# Altium schematic sheet RP2040_MCU.SchDoc: RP2040 CNC
size B; Author: AM; CompanyName: Expatria Technologies; DrawnBy: A.Marles; Engineer: AM; Organization: Expatria Technolgoies; Address1: Schematic; DocumentNumber: 3; SheetNumber: 3; SheetTotal: 4
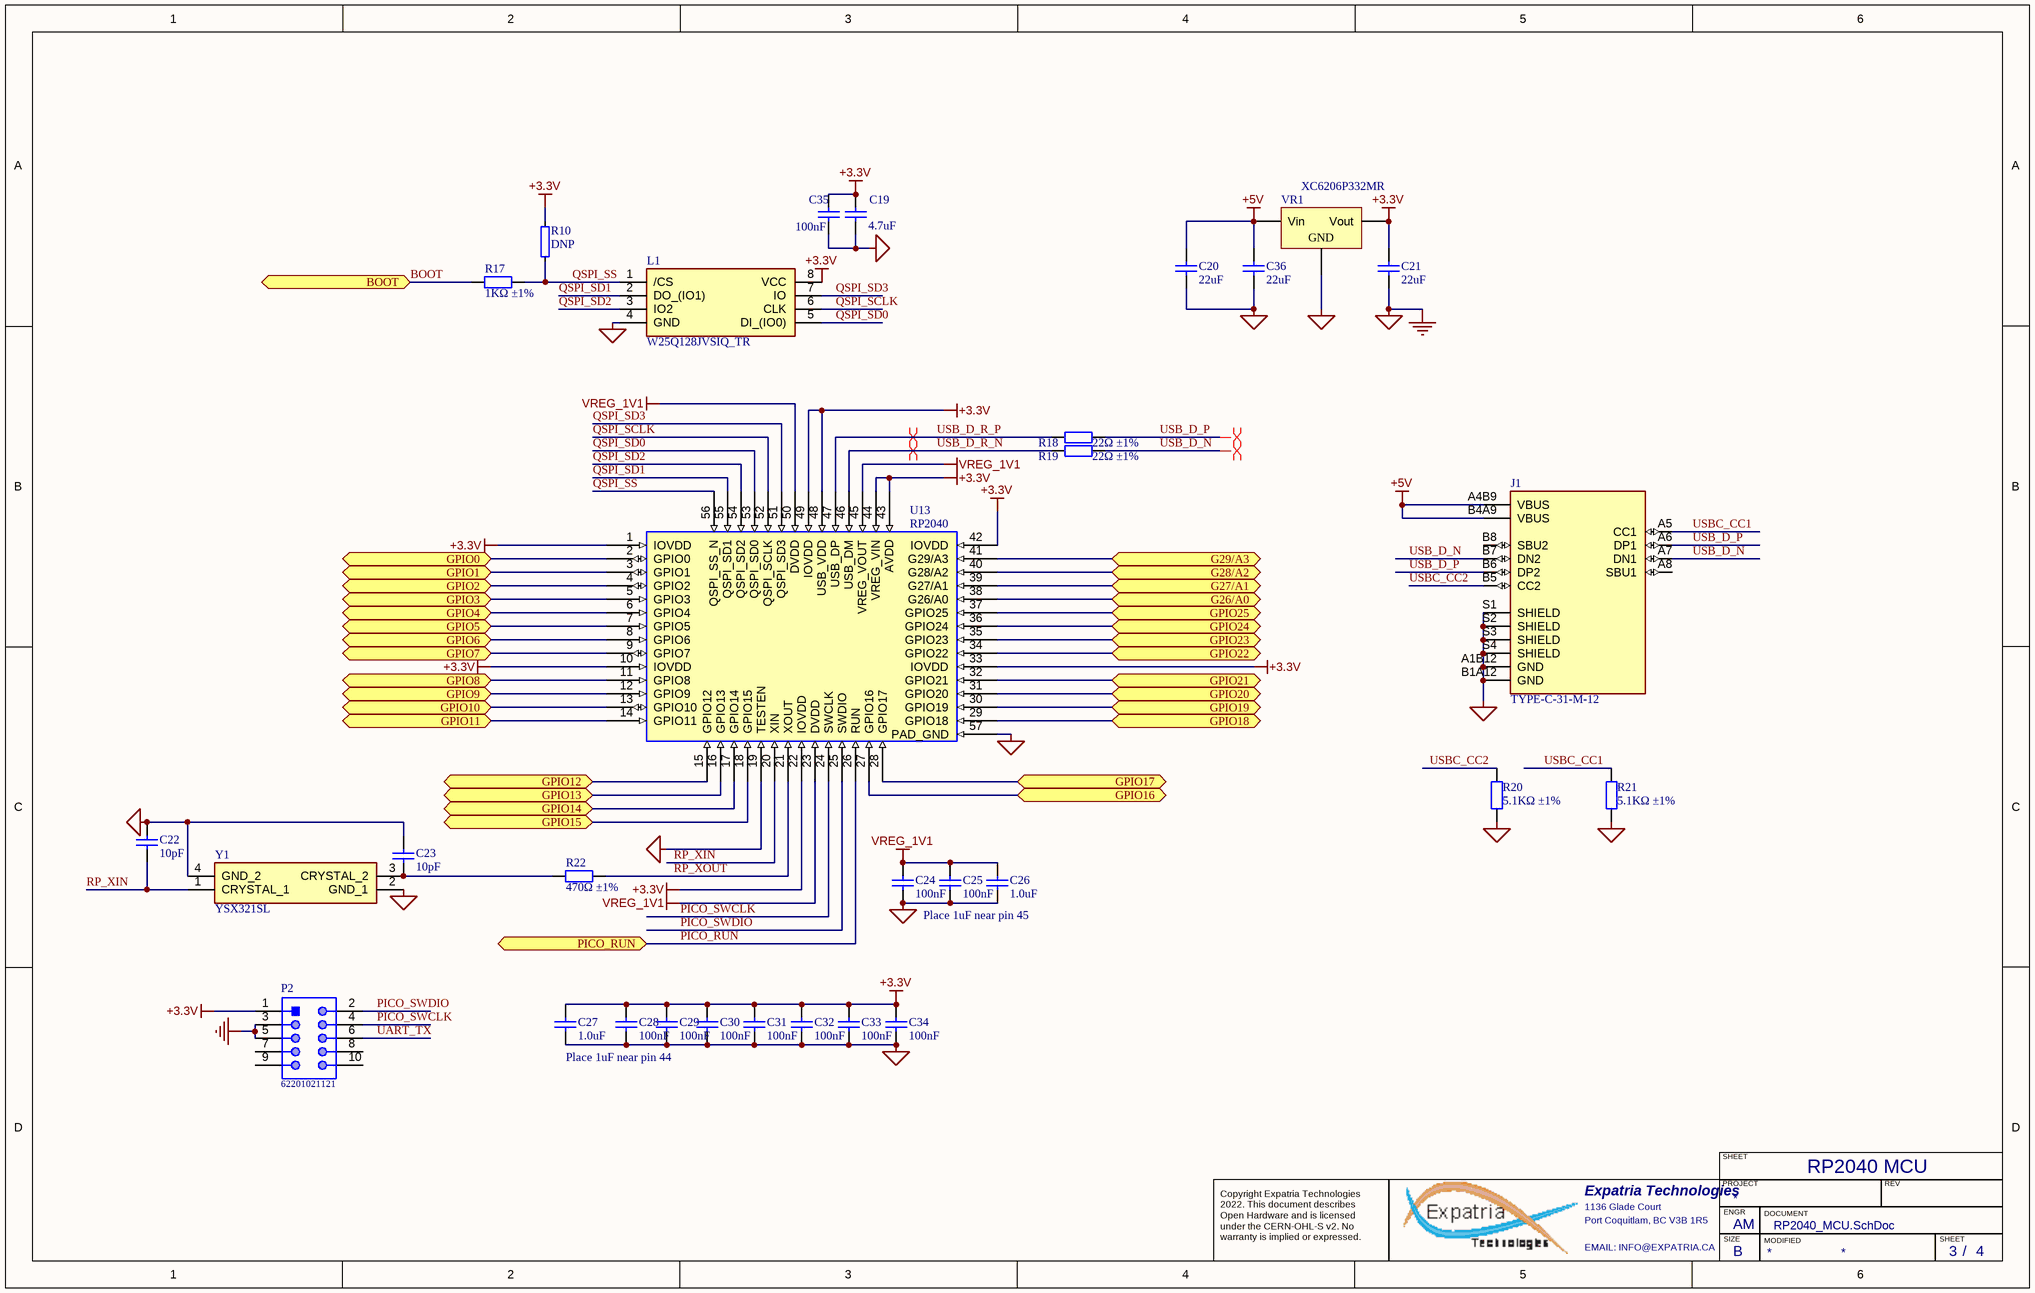
[diagram p0: RP2040_MCU.SchDoc]

## Parts
C19  4.7uF  [0402_C]
C20  22uF  [0805_C]
C21  22uF  [0805_C]
C22  10pF  [0402_C]
C23  10pF  [0402_C]
C24  100nF  [0402_C]
C25  100nF  [0402_C]
C26  1.0uF  [0402_C]
C27  1.0uF  [0402_C]
C28  100nF  [0402_C]
C29  100nF  [0402_C]
C30  100nF  [0402_C]
C31  100nF  [0402_C]
C32  100nF  [0402_C]
C33  100nF  [0402_C]
C34  100nF  [0402_C]
C35  100nF  [0402_C]
C36  22uF  [0805_C]
J1  TYPE-C-31-M-12  [HRO_TYPE-C-31-M-12]
L1  W25Q128JVSIQ_TR  [SOIC127P780X195-8N]
P2  62201021121  [62201021121]  (no BOM)
R10  DNP  [0402]
R17  1KΩ ±1%  [0402_R]
R18  22Ω ±1%  [0402_R]
R19  22Ω ±1%  [0402_R]
R20  5.1KΩ ±1%  [0402_R]
R21  5.1KΩ ±1%  [0402_R]
R22  470Ω ±1%  [0402_R]
U13  RP2040  [RP2040]
VR1  XC6206P332MR  [SOT-23-3L]
Y1  YSX321SL  [YSX321SL]

## Ports
BOOT (bidir), G26/A0 (bidir), G27/A1 (bidir), G28/A2 (bidir), G29/A3 (bidir), GPIO0 (bidir), GPIO1 (bidir), GPIO2 (bidir), GPIO3 (bidir), GPIO4 (bidir), GPIO5 (bidir), GPIO6 (bidir), GPIO7 (bidir), GPIO8 (bidir), GPIO9 (bidir), GPIO10 (bidir), GPIO11 (bidir), GPIO12 (bidir), GPIO13 (bidir), GPIO14 (bidir), GPIO15 (bidir), GPIO16 (bidir), GPIO17 (bidir), GPIO18 (bidir), GPIO19 (bidir), GPIO20 (bidir), GPIO21 (bidir), GPIO22 (bidir), GPIO23 (bidir), GPIO24 (bidir), GPIO25 (bidir), PICO_RUN (bidir)

## Nets
+3.3V: C19.2 C21.2 C27.2 C28.2 C29.2 C30.2 C31.2 C32.2 C33.2 C34.2 C35.2 L1.8(VCC) P2.1 R10.2 U13.1(IOVDD) U13.10(IOVDD) U13.22(IOVDD) U13.33(IOVDD) U13.42(IOVDD) U13.43(AVDD) U13.44(VREG_VIN) U13.48(USB_VDD) U13.49(IOVDD) VR1.2(Vout)
+5V: C20.2 C36.2 J1.A4B9(VBUS) J1.B4A9(VBUS) VR1.3(Vin)
GND: C19.1 C20.1 C21.1 C22.2 C23.2 C24.1 C25.1 C26.1 C27.1 C28.1 C29.1 C30.1 C31.1 C32.1 C33.1 C34.1 C35.1 C36.1 J1.A1B12(GND) J1.B1A12(GND) J1.S1(SHIELD) J1.S2(SHIELD) J1.S3(SHIELD) J1.S4(SHIELD) L1.4(GND) P2.3 P2.5 R20.2 R21.2 U13.19(TESTEN) U13.57(PAD_GND) VR1.1(GND) Y1.2(GND_1) Y1.4(GND_2)  [also labelled MCU_GND]
VREG_1V1: C24.2 C25.2 C26.2 U13.23(DVDD) U13.45(VREG_VOUT) U13.50(DVDD)
BOOT: R17.1 ; port BOOT
G26/A0: U13.38(G26/A0) ; port G26/A0
G27/A1: U13.39(G27/A1) ; port G27/A1
G28/A2: U13.40(G28/A2) ; port G28/A2
G29/A3: U13.41(G29/A3) ; port G29/A3
GPIO0: U13.2(GPIO0) ; port GPIO0
GPIO1: U13.3(GPIO1) ; port GPIO1
GPIO2: U13.4(GPIO2) ; port GPIO2
GPIO3: U13.5(GPIO3) ; port GPIO3
GPIO4: U13.6(GPIO4) ; port GPIO4
GPIO5: U13.7(GPIO5) ; port GPIO5
GPIO6: U13.8(GPIO6) ; port GPIO6
GPIO7: U13.9(GPIO7) ; port GPIO7
GPIO8: U13.11(GPIO8) ; port GPIO8
GPIO9: U13.12(GPIO9) ; port GPIO9
GPIO10: U13.13(GPIO10) ; port GPIO10
GPIO11: U13.14(GPIO11) ; port GPIO11
GPIO12: U13.15(GPIO12) ; port GPIO12
GPIO13: U13.16(GPIO13) ; port GPIO13
GPIO14: U13.17(GPIO14) ; port GPIO14
GPIO15: U13.18(GPIO15) ; port GPIO15
GPIO16: U13.27(GPIO16) ; port GPIO16
GPIO17: U13.28(GPIO17) ; port GPIO17
GPIO18: U13.29(GPIO18) ; port GPIO18
GPIO19: U13.30(GPIO19) ; port GPIO19
GPIO20: U13.31(GPIO20) ; port GPIO20
GPIO21: U13.32(GPIO21) ; port GPIO21
GPIO22: U13.34(GPIO22) ; port GPIO22
GPIO23: U13.35(GPIO23) ; port GPIO23
GPIO24: U13.36(GPIO24) ; port GPIO24
GPIO25: U13.37(GPIO25) ; port GPIO25
PICO_RUN: U13.26(RUN) ; port PICO_RUN
PICO_SWCLK: P2.4 U13.24(SWCLK)
PICO_SWDIO: P2.2 U13.25(SWDIO)
QSPI_SCLK: L1.6(CLK) U13.52(QSPI_SCLK)
QSPI_SD0: L1.5(DI_(IO0)) U13.53(QSPI_SD0)
QSPI_SD1: L1.2(DO_(IO1)) U13.55(QSPI_SD1)
QSPI_SD2: L1.3(IO2) U13.54(QSPI_SD2)
QSPI_SD3: L1.7(IO) U13.51(QSPI_SD3)
QSPI_SS: L1.1(/CS) R10.1 R17.2 U13.56(QSPI_SS_N)
RP_XIN: C22.1 U13.20(XIN) Y1.1(CRYSTAL_1)
RP_XOUT: R22.2 U13.21(XOUT)
UART_TX: P2.6
USB_D_N: J1.A7(DN1) J1.B7(DN2) R19.1
USB_D_P: J1.A6(DP1) J1.B6(DP2) R18.1
USB_D_R_N: R19.2 U13.46(USB_DM)
USB_D_R_P: R18.2 U13.47(USB_DP)
USBC_CC1: J1.A5(CC1) R21.1
USBC_CC2: J1.B5(CC2) R20.1
NetC23_1: C23.1 R22.1 Y1.3(CRYSTAL_2)

Not connected (* = marked no-connect by the designer): J1 A8(SBU1) B8(SBU2); P2 7 8 9 10

## Layout directives
differential pair: USB_D_N, USB_D_P, USB_D_R_N, USB_D_R_P

## Notes on the sheet
- Place 1uF near pin 45
- Place 1uF near pin 44
- RP2040 MCU
- SHEET
- Expatria Technologies
- 1136 Glade Court
- Port Coquitlam, BC V3B 1R5
- PROJECT
- SIZE
- ENGR
- MODIFIED
- DOCUMENT
- REV
- Copyright Expatria Technologies 2022. This document describes Open Hardware and is licensed under the CERN-OHL-S v2. No warranty is implied or expressed.
- EMAIL: INFO@EXPATRIA.CA
- B
- /

## Library data of the parts
C19 = 0402 4.7uF (475) 20% 10V: Chip capacitor; Manufacturer: Samsung Electro-Mechanics; PartNumber: CL05A475MP5NRNC; Tolerance: 20%; Voltage: 10V; ComponentLink1Description: Supplier link; ComponentLink1URL: http://www.szlcsc.com/product/details_24469.html; Package: 0402; Supplier: LC; SuppliersPartNumber: C23733; Capacitance: 4.7uF
C20 C21 C36 = 0805 22uF (226) 20% 25V: Chip capacitors; Manufacturer: Samsung Electro-Mechanics; PartNumber: CL21A226MAQNNNE; Tolerance: 20%; Voltage: 25V; Package: 0805; Supplier: LC; SuppliersPartNumber: C2922481; Capacitance: 22uF; ComponentLink1Description: Supplier link; ComponentLink1URL: http://www.szlcsc.com/product/details_46786.html
C22 C23 = 0402 10pF (100) 5% 50V: Chip capacitors; Manufacturer: Samsung Electro-Mechanics; PartNumber: CL05C100JB5NNNC; Tolerance: 5%; Voltage: 50V; ComponentLink1Description: Supplier link; ComponentLink1URL: http://www.szlcsc.com/product/details_33914.html; Package: 0402; Supplier: LC; SuppliersPartNumber: C32949; Capacitance: 10pF
C24 C25 C28-C35 = 0402 100nF (104) 10% 16V: Chip capacitors; Manufacturer: Samsung Electro-Mechanics; PartNumber: CL05B104KO5NNNC; Tolerance: 10%; Voltage: 16V; ComponentLink1Description: Supplier link; ComponentLink1URL: http://www.szlcsc.com/product/details_1877.html; Package: 0402; Supplier: LC; SuppliersPartNumber: C1525; Capacitance: 100nF
C26 C27 = 0402 1.0uF (105) 10% 25V: Chip capacitor; Manufacturer: Samsung Electro-Mechanics; PartNumber: CL05A105KA5NQNC; Capacitance: 1uF; Tolerance: 10%; Voltage: 25V; ComponentLink1Description: Supplier link; ComponentLink1URL: http://www.szlcsc.com/product/details_53938.html; Package: 0402; Supplier: LC; SuppliersPartNumber: C52923
J1 = TYPE-C-31-M-12: USB Connectors 24 Receptacle 1 8.94*7.3mm RoHS; MF: HRO Electronics Co., Ltd.; Value: *; SnapEDA_Link: https://www.snapeda.com/parts/TYPE-C-31-M-12/HRO%20Electronics%20Co.,%20Ltd./view-part/3228496/?ref=snap; Package: Package; MP: TYPE-C-31-M-12; Price: None; Availability: Unavailable; SuppliersPartNumber: C165948
L1 = W25Q128JVSIQ_TR: Inductor; Manufacturer_Name: Winbond; Manufacturer_Part_Number: W25Q128JVSIQ TR; Datasheet Link: http://www.winbond.com/resource-files/w25q128jv%20spi%20revc%2011162016.pdf; Height: 1.95mm; Mouser Part Number: 454-W25Q128JVSIQTR; Mouser Price/Stock: https://www.mouser.co.uk/ProductDetail/Winbond/W25Q128JVSIQ-TR?qs=qSfuJ%252Bfl%2Fd7vTyLA9kNdGw%3D%3D; Arrow Part Number: W25Q128JVSIQ TR; Arrow Price/Stock: https://www.arrow.com/en/products/w25q128jvsiqtr/winbond-electronics?region=nac; SuppliersPartNumber: C97521
P2 = CMP-1502-00948-1: THT Vertical Pin Header WR-PHD, Pitch 1.27 mm, Dual Row, 10 pins; Manufacturer: Wurth Elektronik; Rated Current: 1A; Pin Number: 10; Working Voltage: 100VAC; Contact Resistance: 20mOhm; Withstanding Voltage: 500VAC; Pitch: 1.27mm; Gender: Male; Mounting Technology: THT; Manufacturer URL: http://www.we-online.de; Package Reference: 62201021121; Row Number: Dual; Datasheet URL: https://katalog.we-online.de/em/datasheet/62201021121.pdf; Publisher: WurthElektronik; Packaging: Box; Operating Temperature: -40to105degC; Orientation: Vertical; Part Number: 62201021121
R10 = RES: Resistor, ±5%, 0.05W; Part Number: R0201-0R; Part number IPS: 00000003245; Value: 0R; Note: Chip Res 5%; Artikkelnr Noca: N.A.; Manufacturer: *; Manufacturer Part Number: *; ComponentLink1URL: *; ComponentLink1Description: Datasheet; ComponentLink2URL: *; ComponentLink2Description: Supplier link; HelpURL: *; Footprint Doc: 0201; LatestRevisionDate: 2017-11-09; Pin Count: 2; Publisher: Nordic Semiconductor; Published: 2014-11-13; Supplier 1: *; Supplier Part Number 1: *; Supplier 2: *; Supplier Part Number 2: *
R17 = 0402 1K (1001) 1%: Chip resistor; Manufacturer: Uniroyal Elec; PartNumber: 0402WGF1001TCE; Power: 1/16W; ComponentLink1Description: Supplier link; ComponentLink1URL: http://www.szlcsc.com/product/details_12256.html; Package: 0402; Supplier: LC; SuppliersPartNumber: C11702; Resistance: 1KΩ; Tolerance: 1%
R18 R19 = 0402 22R (22R0) 1%: Chip resistor; Manufacturer: Uniroyal Elec; PartNumber: 0402WGF220JTCE; Power: 1/16W; ComponentLink1Description: Supplier link; ComponentLink1URL: http://www.szlcsc.com/product/details_25835.html; Package: 0402; Supplier: LC; SuppliersPartNumber: C25092; Resistance: 22Ω; Tolerance: 1%
R20 R21 = 0402 5.1K (5101) 1%: Chip resistor; Manufacturer: Uniroyal Elec; PartNumber: 0402WGF5101TCE; Power: 1/16W; Resistance: 51.1KΩ; ComponentLink1Description: Supplier link; ComponentLink1URL: http://www.szlcsc.com/product/details_26648.html; Package: 0402; Supplier: LC; SuppliersPartNumber: C25905; Tolerance: 1%
R22 = 0402 470R (4700) 1%: Chip resistor; Manufacturer: Uniroyal Elec; PartNumber: 0402WGF4700TCE; Power: 1/16W; ComponentLink1Description: Supplier link; ComponentLink1URL: http://www.szlcsc.com/product/details_25860.html; Package: 0402; Supplier: LC; SuppliersPartNumber: C25117; Resistance: 470Ω; Tolerance: 1%
U13 = RP2040: RP2040 First MCU from RPI
VR1 = SOT-23 XC6206P332MR: 200mA 680mV@(100mA) Fixed 3.3V~3.3V Positive 1 6V SOT-23-3L Linear Voltage Regulators (LDO) ROHS; ComponentLink1Description: 供应商链接; ComponentLink1URL: http://www.szlcsc.com/product/details_5896.html; Package: SOT-23; Supplier: LC; SuppliersPartNumber: C5446
Y1 = YSX321SL: Crystal or Oscillator; Manufacturer_Name: YXC; Datasheet Link: https://datasheet.lcsc.com/szlcsc/YSX321SL-30MHZ-10PF-8PPM_C70576.pdf; Height: 0.8mm; Manufacturer_Part_Number: YSX321SL; SuppliersPartNumber: C9002